# EAGLE design ub-1 (EAGLE 7.5.0)

## Sheet 1 of 2
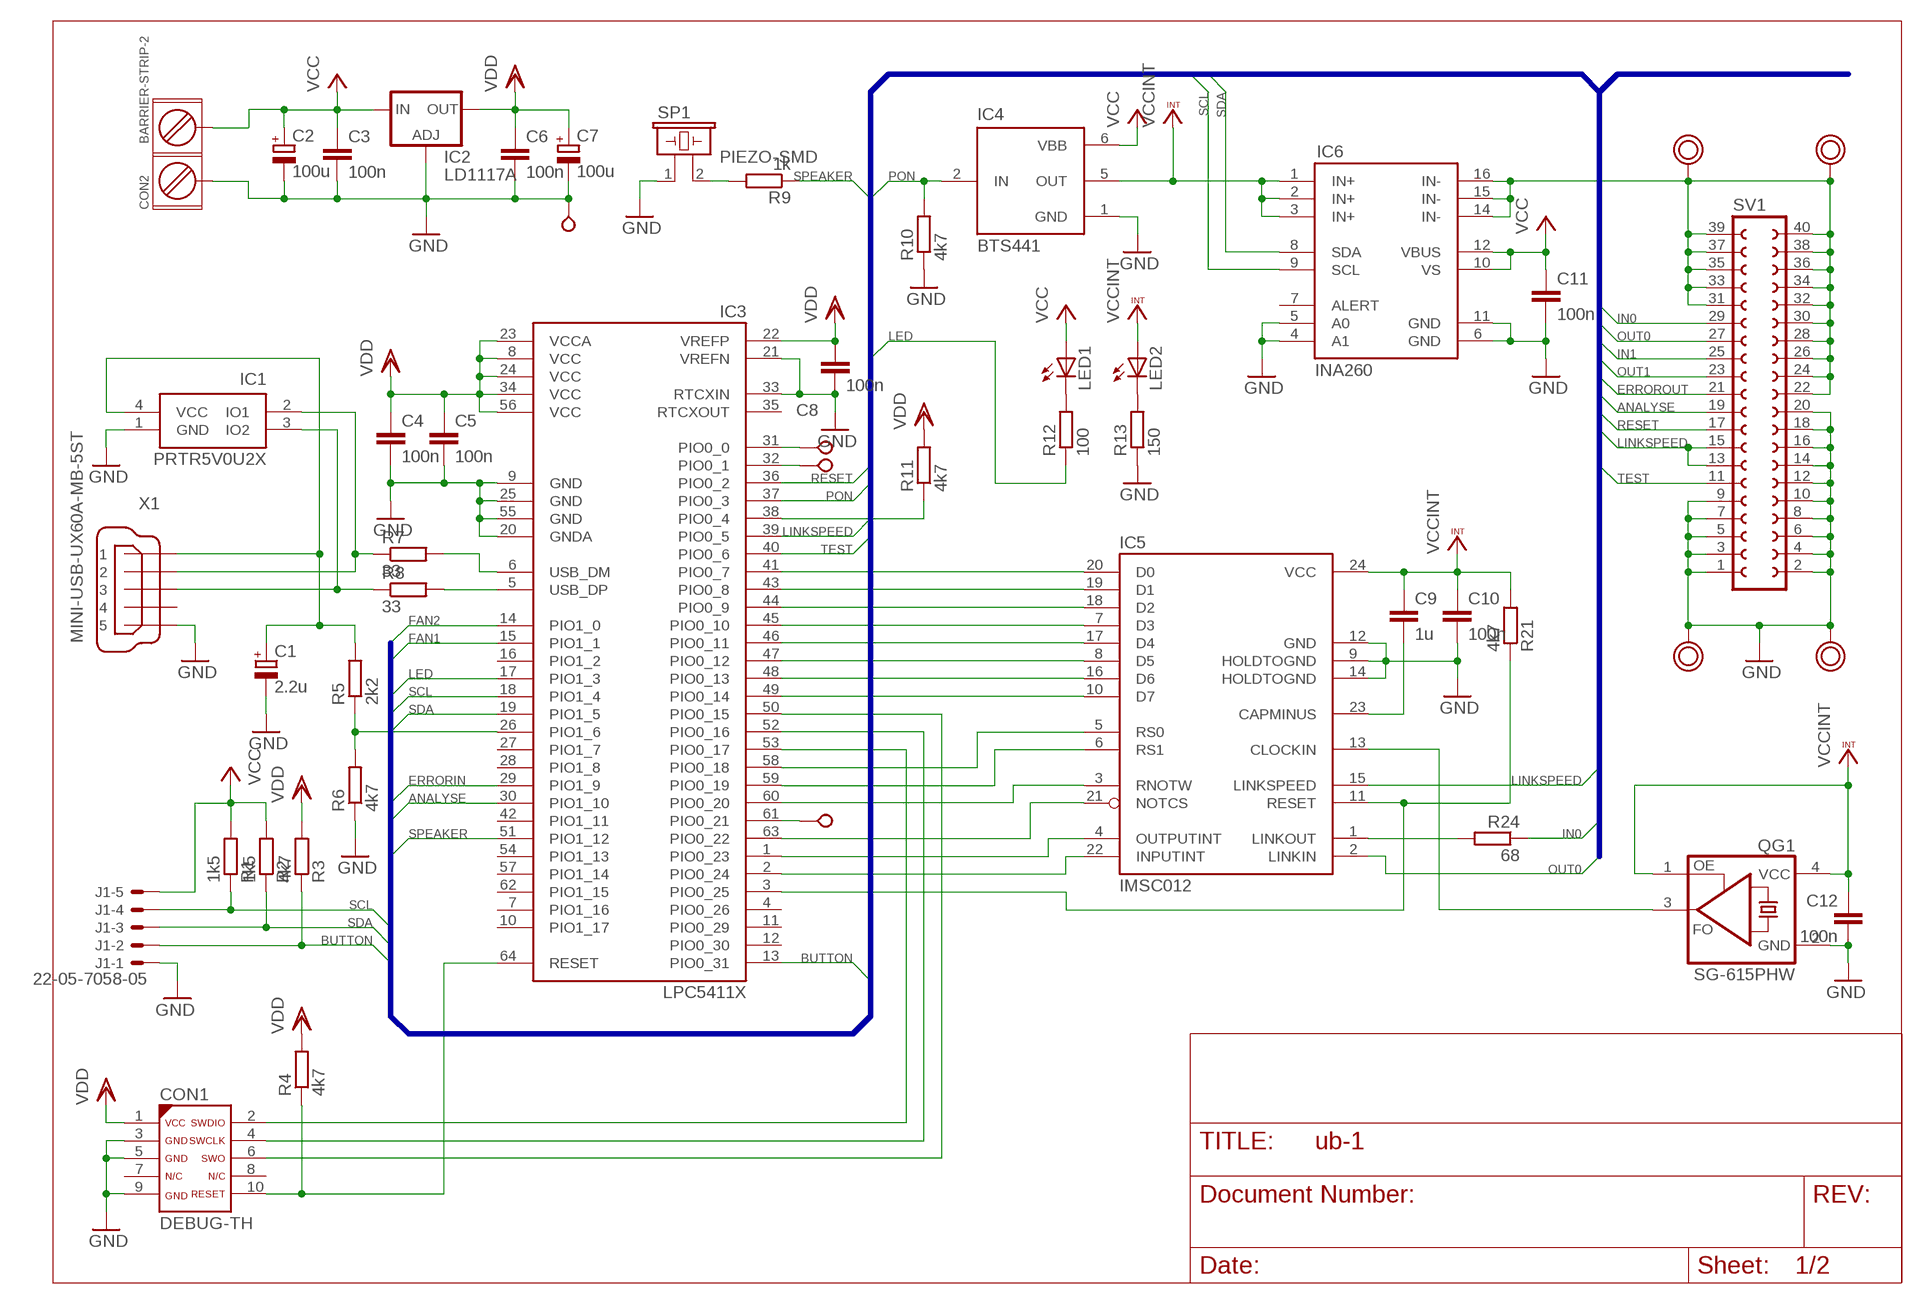
[diagram p0: schematic, sheet 1]

### Parts
C1  2.2u  CPOL-EUSMCB  [SMC_B]
C2  100u  CPOL-EUSMCB  [SMC_B]
C3  100n  C-EUC1206  [C1206]
C4  100n  C-EUC1206  [C1206]
C5  100n  C-EUC1206  [C1206]
C6  100n  C-EUC1206  [C1206]
C7  100u  CPOL-EUSMCB  [SMC_B]
C8  100n  C-EUC1206  [C1206]
C9  1u  C-EUC1206  [C1206]
C10  100n  C-EUC1206  [C1206]
C11  100n  C-EUC1206  [C1206]
C12  100n  C-EUC1206  [C1206]
CON1  DEBUG-TH  [DEBUG-TH]
CON2  BARRIER-STRIP-2  [BARRIER-STRIP-2]
IC1  PRTR5V0U2X  [SOT143]
IC2  LD1117A  [SOT223]
IC3  LPC5411X  [LQPF64]
IC4  BTS441  [TO263-4]
IC5  IMSC012  [DIL24-3]
IC6  INA260  [TSSOP-16]
J1  22-05-7058-05  [7395-05]
LED1  LEDSMT1206  [1206]
LED2  LEDSMT1206  [1206]
QG1  SG-615PHW  [SG-615]
R1  1k5  R-EU_R1206  [R1206]
R2  1k5  R-EU_R1206  [R1206]
R3  4k7  R-EU_R1206  [R1206]
R4  4k7  R-EU_R1206  [R1206]
R5  2k2  R-EU_R1206  [R1206]
R6  4k7  R-EU_R1206  [R1206]
R7  33  R-EU_R1206  [R1206]
R8  33  R-EU_R1206  [R1206]
R9  1k  R-EU_R1206  [R1206]
R10  4k7  R-EU_R1206  [R1206]
R11  4k7  R-EU_R1206  [R1206]
R12  100  R-EU_R1206  [R1206]
R13  150  R-EU_R1206  [R1206]
R21  4k7  R-EU_R1206  [R1206]
R24  68  R-EU_R1206  [R1206]
SCREW1  POWERPAD  [POWERPAD]
SCREW2  POWERPAD  [POWERPAD]
SCREW3  POWERPAD  [POWERPAD]
SCREW4  POWERPAD  [POWERPAD]
SP1  PIEZO-SMD  [PIEZO-SMD]
SV1  FE20-2  [FE20-2]
TP1  TESTPOINT  [VERO_TP]
TP2  TESTPOINT  [VERO_TP]
TP3  TESTPOINT  [VERO_TP]
TP4  TESTPOINT  [VERO_TP]
X1  MINI-USB-UX60A-MB-5ST  [UX60A-MB-5ST]

### Nets
ANALYSE: IC3.30(PIO1_10) SV1.19 ; also sheet 2
BUTTON: IC3.13(PIO0_31) J1.2 R3.1
ERRORIN: IC3.29(PIO1_9) ; also sheet 2
ERROROUT: SV1.21 ; also sheet 2
FAN1: IC3.15(PIO1_1) ; also sheet 2
FAN2: IC3.14(PIO1_0) ; also sheet 2
GND: C1.- C2.- C3.2 C4.2 C5.2 C6.2 C7.- C8.2 C10.2 C11.2 C12.2 CON1.3 CON1.5 CON1.9 CON2.1 IC1.1(GND) IC2.1(ADJ) IC3.9(GND) IC3.20(GNDA) IC3.21(VREFN) IC3.25(GND) IC3.33(RTCXIN) IC3.55(GND) IC4.1(GND) IC5.9(HOLDTOGND) IC5.12(GND) IC5.14(HOLDTOGND) IC6.4(A1) IC6.5(A0) IC6.6(GND) IC6.11(GND) J1.1 QG1.2(GND) R6.1 R10.1 R13.1 SCREW2.P$1 SCREW4.P$1 SP1.1 SV1.1 SV1.2 SV1.3 SV1.4 SV1.5 SV1.6 SV1.7 SV1.8 SV1.9 SV1.10 SV1.12 SV1.14 SV1.16 SV1.18 SV1.20 TP3.P$1 X1.5 ; also sheet 2
IN0: R24.1 SV1.29
IN1: SV1.25 ; also sheet 2
LED: IC3.17(PIO1_3) R12.1
LINKSPEED: IC3.39(PIO0_5) IC5.15(LINKSPEED) SV1.13 SV1.15
N$31: CON1.2 IC3.53(PIO0_17)
N$34: IC3.31(PIO0_0) TP1.P$1
N$35: CON1.4 IC3.52(PIO0_16)
N$36: CON1.10 IC3.64(RESET) R4.1
N$37: IC3.26(PIO1_6) R5.1 R6.2
N$38: IC3.5(USB_DP) R8.2
N$39: IC3.6(USB_DM) R7.2
N$40: IC6.14(IN-) IC6.15(IN-) IC6.16(IN-) SCREW1.P$1 SCREW3.P$1 SV1.22 SV1.24 SV1.26 SV1.28 SV1.30 SV1.31 SV1.32 SV1.33 SV1.34 SV1.35 SV1.36 SV1.37 SV1.38 SV1.39 SV1.40
N$41: IC3.41(PIO0_7) IC5.20(D0)
N$42: IC3.32(PIO0_1) TP2.P$1
N$43: IC3.61(PIO0_21) TP4.P$1
N$44: IC5.1(LINKOUT) R24.2
N$45: IC3.43(PIO0_8) IC5.19(D1)
N$46: IC3.44(PIO0_9) IC5.18(D2)
N$47: IC3.45(PIO0_10) IC5.7(D3)
N$48: IC3.46(PIO0_11) IC5.17(D4)
N$49: IC3.47(PIO0_12) IC5.8(D5)
N$50: IC3.48(PIO0_13) IC5.16(D6)
N$51: IC3.49(PIO0_14) IC5.10(D7)
N$52: IC3.60(PIO0_20) IC5.3(RNOTW)
N$53: IC3.59(PIO0_19) IC5.6(RS1)
N$54: IC3.58(PIO0_18) IC5.5(RS0)
N$55: IC3.1(PIO0_23) IC5.4(OUTPUTINT)
N$56: IC3.2(PIO0_24) IC5.22(INPUTINT)
N$57: IC3.63(PIO0_22) IC5.21(NOTCS)
N$58: IC5.13(CLOCKIN) QG1.3(FO)
N$60: C9.2 IC5.23(CAPMINUS)
N$61: IC1.2(IO1) R7.1 X1.2
N$62: IC1.3(IO2) R8.1 X1.3
N$63: LED2.C R13.2
N$64: R9.2 SP1.2
N$65: LED1.C R12.2
N$71: CON1.6 IC3.50(PIO0_15)
N$72: IC3.38(PIO0_4) R11.1
N$73: IC3.3(PIO0_25) IC5.11(RESET) R21.1
OUT0: IC5.2(LINKIN) SV1.27
OUT1: SV1.23 ; also sheet 2
PON: IC3.37(PIO0_3) IC4.2(IN) R10.2 ; also sheet 2
RESET: IC3.36(PIO0_2) SV1.17 ; also sheet 2
SCL: IC3.18(PIO1_4) IC6.9(SCL) J1.4 R1.1
SDA: IC3.19(PIO1_5) IC6.8(SDA) J1.3 R2.1
SPEAKER: IC3.51(PIO1_12) R9.1
TEST: IC3.40(PIO0_6) SV1.11
VCC: C2.+ C3.1 C11.1 CON2.2 IC2.3(IN) IC4.6(VBB) IC6.10(VS) IC6.12(VBUS) J1.5 LED1.A R1.2 R2.2 ; also sheet 2
VCCINT: C9.1 C10.1 C12.1 IC4.5(OUT) IC5.24(VCC) IC6.1(IN+) IC6.2(IN+) IC6.3(IN+) LED2.A QG1.1(OE) QG1.4(VCC) R21.2 ; also sheet 2
VDD: C4.1 C5.1 C6.1 C7.+ C8.1 CON1.1 IC2.2(OUT) IC3.8(VCC) IC3.22(VREFP) IC3.23(VCCA) IC3.24(VCC) IC3.34(VCC) IC3.56(VCC) R3.2 R4.2 R11.2
VUSB: C1.+ IC1.4(VCC) R5.2 X1.1
Unconnected: CON1.7 CON1.8 IC3.4(PIO0_26) IC3.7(PIO1_16) IC3.10(PIO1_17) IC3.11(PIO0_29) IC3.12(PIO0_30) IC3.16(PIO1_2) IC3.27(PIO1_7) IC3.28(PIO1_8) IC3.35(RTCXOUT) IC3.42(PIO1_11) IC3.54(PIO1_13) IC3.57(PIO1_14) IC3.62(PIO1_15) IC6.7(ALERT) X1.4

### Buses
IN[0..1],OUT[0..1],ERROROUT,ERRORIN,ANALYSE,RESET,PON,LINKSPEED,TEST,FAN[1..2],VUSB,SPEAKER,SDA,SCL,BUTTON,LED

## Sheet 2 of 2
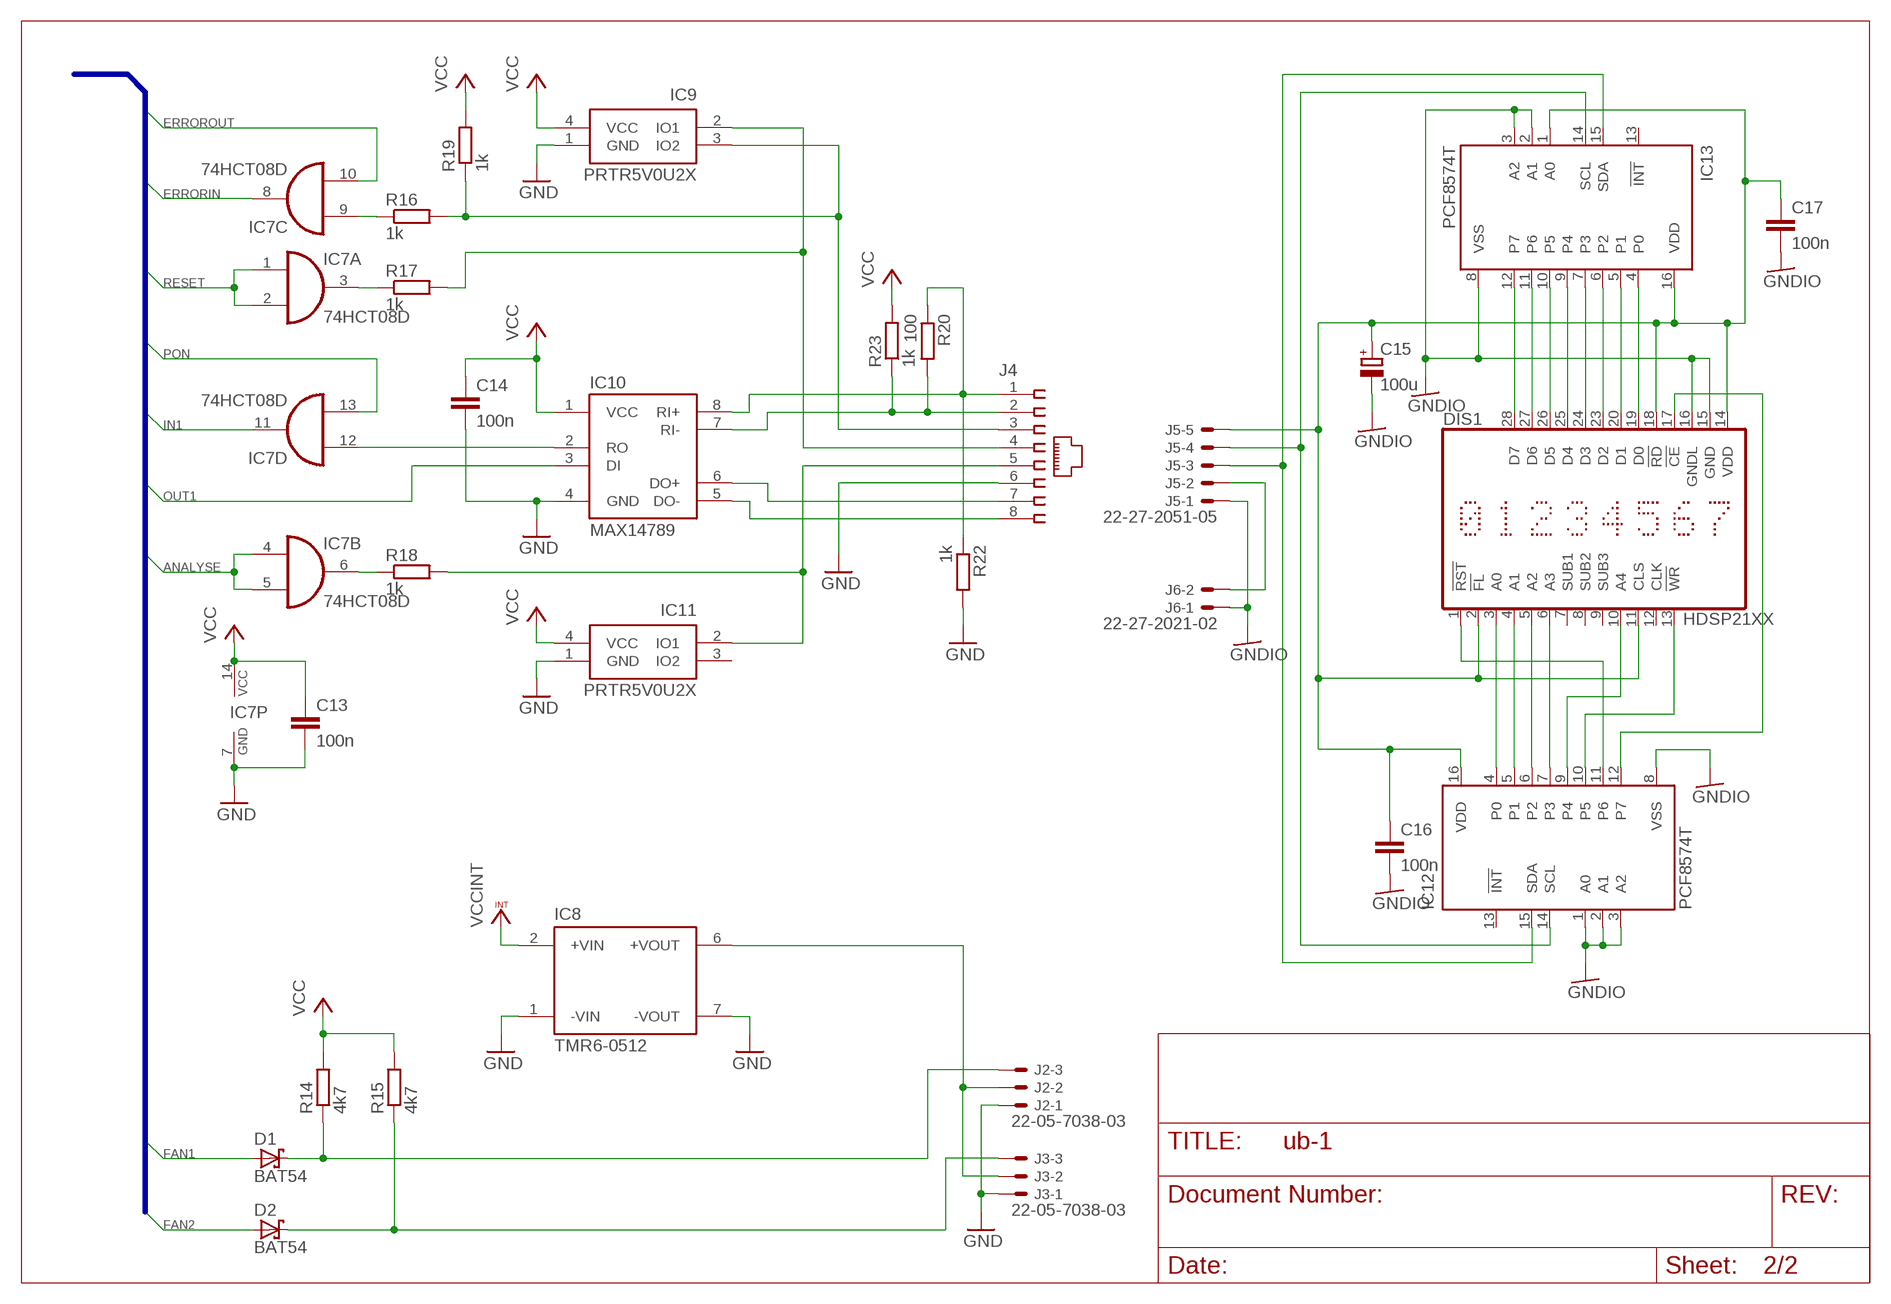
[diagram p1: schematic, sheet 2]

### Parts
C13  100n  C-EUC1206  [C1206]
C14  100n  C-EUC1206  [C1206]
C15  100u  CPOL-EUSMCB  [SMC_B]
C16  100n  C-EUC1206  [C1206]
C17  100n  C-EUC1206  [C1206]
D1  BAT54  [SOT23]
D2  BAT54  [SOT23]
DIS1  HDSP21XX  [HDSP21XX]
IC7  74HCT08D  [SO14]
IC8  TMR6-0512  [TMR6-0512]
IC9  PRTR5V0U2X  [SOT143]
IC10  MAX14789  DS8921  [SO8]
IC11  PRTR5V0U2X  [SOT143]
IC12  PCF8574T  [SO16W]
IC13  PCF8574T  [SO16W]
J2  22-05-7038-03  [7395-03]
J3  22-05-7038-03  [7395-03]
J4  555164-1  [555164-1]
J5  22-27-2051-05  [6410-05]
J6  22-27-2021-02  [6410-02]
R14  4k7  R-EU_R1206  [R1206]
R15  4k7  R-EU_R1206  [R1206]
R16  1k  R-EU_R1206  [R1206]
R17  1k  R-EU_R1206  [R1206]
R18  1k  R-EU_R1206  [R1206]
R19  1k  R-EU_R1206  [R1206]
R20  100  R-EU_R1206  [R1206]
R22  1k  R-EU_R1206  [R1206]
R23  1k  R-EU_R1206  [R1206]

### Nets
ANALYSE: IC7.4(B:I0) IC7.5(B:I1) ; also sheet 1
ERRORIN: IC7.8(C:O) ; also sheet 1
ERROROUT: IC7.10(C:I1) ; also sheet 1
FAN1: D1.1(A) ; also sheet 1
FAN2: D2.1(A) ; also sheet 1
GND: C13.2 C14.2 IC7.7(P:GND) IC8.1(-VIN) IC8.7(-VOUT) IC9.1(GND) IC10.4(GND) IC11.1(GND) J2.1 J3.1 J4.6 R22.2 ; also sheet 1
GNDIO: C15.- C16.2 C17.2 DIS1.15(GND) DIS1.16(GNDL) IC12.1(A0) IC12.2(A1) IC12.3(A2) IC12.8(VSS) IC13.2(A1) IC13.3(A2) IC13.8(VSS) J5.1 J6.1
IN1: IC7.11(D:O) ; also sheet 1
N$1: DIS1.3(A0) IC12.4(P0)
N$2: DIS1.19(D0) IC13.4(P0)
N$3: DIS1.20(D1) IC13.5(P1)
N$4: DIS1.23(D2) IC13.6(P2)
N$5: DIS1.24(D3) IC13.7(P3)
N$6: DIS1.25(D4) IC13.9(P4)
N$7: DIS1.26(D5) IC13.10(P5)
N$8: DIS1.27(D6) IC13.11(P6)
N$9: DIS1.28(D7) IC13.12(P7)
N$10: DIS1.4(A1) IC12.5(P1)
N$11: DIS1.5(A2) IC12.6(P2)
N$12: DIS1.6(A3) IC12.7(P3)
N$13: DIS1.10(A4) IC12.9(P4)
N$14: J5.2 J6.2
N$15: C15.+ C16.1 C17.1 DIS1.2(!FL) DIS1.11(CLS) DIS1.14(VDD) DIS1.18(!RD) IC12.16(VDD) IC13.1(A0) IC13.16(VDD) J5.5
N$16: DIS1.1(!RST) IC12.11(P6)
N$17: DIS1.13(!WR) IC12.10(P5)
N$18: IC12.14(SCL) IC13.14(SCL) J5.4
N$19: DIS1.17(!CE) IC12.12(P7)
N$20: IC12.15(SDA) IC13.15(SDA) J5.3
N$21: IC10.8(RI+) J4.1 R20.1 R22.1
N$22: IC10.7(RI-) J4.2 R20.2 R23.1
N$23: IC10.5(DO-) J4.8
N$24: IC10.6(DO+) J4.7
N$25: IC7.6(B:O) R18.1
N$26: IC7.3(A:O) R17.1
N$27: IC7.9(C:I0) R16.1
N$28: IC9.3(IO2) J4.3 R16.2 R19.1
N$29: IC9.2(IO1) J4.4 R17.2
N$30: IC11.2(IO1) J4.5 R18.2
N$32: IC7.12(D:I0) IC10.2(RO)
N$33: D2.3(C) J3.3 R15.1
N$59: D1.3(C) J2.3 R14.1
N$67: IC8.6(+VOUT) J2.2 J3.2
OUT1: IC10.3(DI) ; also sheet 1
PON: IC7.13(D:I1) ; also sheet 1
RESET: IC7.1(A:I0) IC7.2(A:I1) ; also sheet 1
VCC: C13.1 C14.1 IC7.14(P:VCC) IC9.4(VCC) IC10.1(VCC) IC11.4(VCC) R14.2 R15.2 R19.2 R23.2 ; also sheet 1
VCCINT: IC8.2(+VIN) ; also sheet 1
Unconnected: DIS1.7(SUB1) DIS1.8(SUB2) DIS1.9(SUB3) DIS1.12(CLK) IC11.3(IO2) IC12.13(!INT) IC13.13(!INT)

### Buses
IN[0..1],OUT[0..1],ERROROUT,ERRORIN,ANALYSE,RESET,PON,LINKSPEED,TEST,FAN[1..2],VUSB,SPEAKER,SDA,SCL,BUTTON,LED

## Library data of the parts
C1 = rcl:CPOL-EU: POLARIZED CAPACITOR, European symbol; DIGIKEY: 478-3880-1-ND
C2 C7 C15 = rcl:CPOL-EU: POLARIZED CAPACITOR, European symbol; DIGIKEY: 478-5801-1-ND
C3-C6 C8 C10-C14 C16 C17 = rcl:C-EU: CAPACITOR, European symbol; DIGIKEY: 478-10855-1-ND
C9 = rcl:C-EU: CAPACITOR, European symbol; DIGIKEY: 478-1567-1-ND
CON1 = Transputer:DEBUG; DIGIKEY: 1175-1627-ND
CON2 = Transputer:BARRIER-STRIP-2; DIGIKEY: WM13929-ND
D1 D2 = diode:BAT54: Schottky Diodes Source: Fairchild .. BAT54.pdf; DIGIKEY: BAT54FSCT-ND
DIS1 = display-hp:HDSP21XX: LED DISPLAY 8-character dot matrix; DIGIKEY: 516-1161-5-ND; MF: AGILENT TECHNOLOGIES; MPN: HDSP-2179; OC_FARNELL: 1175588; OC_NEWARK: 06B1344
IC1 IC9 IC11 = Transputer:PRTR5V0U2X; DIGIKEY: 1727-3884-1-ND
IC2 = Transputer:LD1117A; DIGIKEY: 497-1228-1-ND
IC3 = Transputer:LPC5411X; DIGIKEY: 568-13034-ND
IC4 = Transputer:BTS441; DIGIKEY: BTS441TGATMA1CT-ND
IC5 = Transputer:IMSC012
IC6 = Transputer:INA260; DIGIKEY: 296-47777-1-ND
IC7 = 74xx-eu:74*08: Quad 2-input AND gate; DIGIKEY: 296-14862-1-ND
IC8 = Transputer:TMR6-0512; DIGIKEY: 1951-2391-ND
IC10 = Transputer:DS8921; DIGIKEY: MAX14789EGSA+-ND
IC12 IC13 = micro-philips:PCF8574: I2C-Bus Remote 8-bit I/O expander http://www.semiconductors.philips.com/acrobat_download/datasheets/PCF8574_4.pdf; DIGIKEY: 568-1077-1-ND; MPN: PCF8574T/3,512; OC_FARNELL: 1201255; OC_NEWARK: 70R6870
J1 = con-molex:22-?-05: CONNECTOR wire to board 2.54 mm (.1 inch) pitch header; DIGIKEY: WM2787-ND; OC_FARNELL: unknown; OC_NEWARK: unknown
J2 J3 = con-molex:22-?-03: CONNECTOR wire to board 2.54 mm (.1 inch) pitch header; DIGIKEY: WM2785-ND; OC_FARNELL: unknown; OC_NEWARK: unknown
J4 = con-amp:555164-1: AMP connector; DIGIKEY: A31442-ND
J5 = con-molex:22-?-05: CONNECTOR wire to board 2.54 mm (.1 inch) pitch header; DIGIKEY: WM4114-ND; OC_FARNELL: unknown; OC_NEWARK: unknown
J6 = con-molex:22-?-02: CONNECTOR wire to board 2.54 mm (.1 inch) pitch header; DIGIKEY: WM4111-ND; OC_FARNELL: unknown; OC_NEWARK: unknown
LED1 LED2 = led:LED: LED OSRAM: - CHIPLED LG R971, LG N971, LY N971, LG Q971, LY Q971, LO R971, LY R971 LH N974, LH R974 LS Q976, LO Q976, LY Q976 LO Q996 - Hyper CHIPLED LW Q18S LB Q993, LB Q99A, LB R99A - SideLED LS A670, LO A670, LY A670, LG A670, LP A670 LB A673, LV A673, LT A673, LW A673 LH A674 LY A675 LS A676, LA A676, LO A676, LY A676, LW A676 LS A679, LY A679, LG A679 - Hyper Micro SIDELED® LS Y876, LA Y876, LO Y876, LY Y876 LT Y87S - SmartLED LW L88C, LW L88S LB L89C, LB L89S, LG L890 LS L89K, LO L89K, LY L89K LS L896, LA L896, LO L896, LY L896 - TOPLED LS T670, LO T670, LY T670, LG T670, LP T670 LSG T670, LSP T670, LSY T670, LOP T670, LYG T670 LG T671, LOG T671, LSG T671 LB T673, LV T673, LT T673, LW T673 LH T674 LS T676, LA T676, LO T676, LY T676, LB T676, LH T676, LSB T676, LW T676 LB T67C, LV T67C, LT T67C, LS T67K, LO T67K, LY T67K, LW E67C LS E67B, LA E67B, LO E67B, LY E67B, LB E67C, LV E67C, LT E67C LW T67C LS T679, LY T679, LG T679 LS T770, LO T770, LY T770, LG T770, LP T770 LB T773, LV T773, LT T773, LW T773 LH T774 LS E675, LA E675, LY E675, LS T675 LS T776, LA T776, LO T776, LY T776, LB T776 LHGB T686 LT T68C, LB T68C - Hyper Mini TOPLED® LB M676 - Mini TOPLED Santana® LG M470 LS M47K, LO M47K, LY M47K Source: http://www.osram.convergy.de LUXEON: - LUMILED® LXK2-PW12-R00, LXK2-PW12-S00, LXK2-PW14-U00, LXK2-PW14-V00 LXK2-PM12-R00, LXK2-PM12-S00, LXK2-PM14-U00 LXK2-PE12-Q00, LXK2-PE12-R00, LXK2-PE12-S00, LXK2-PE14-T00, LXK2-PE14-U00 LXK2-PB12-K00, LXK2-PB12-L00, LXK2-PB12-M00, LXK2-PB14-N00, LXK2-PB14-P00, LXK2-PB14-Q00 LXK2-PR12-L00, LXK2-PR12-M00, LXK2-PR14-Q00, LXK2-PR14-R00 LXK2-PD12-Q00, LXK2-PD12-R00, LXK2-PD12-S00 LXK2-PH12-R00, LXK2-PH12-S00 LXK2-PL12-P00, LXK2-PL12-Q00, LXK2-PL12-R00 Source: www.luxeon.com KINGBRIGHT: KA-3528ASYC Source: www.kingbright.com; DIGIKEY: 160-1404-1-ND
QG1 = crystal:SG-615: SOJ HIGH-FREQUENCY CRYSTAL OSCILLATOR Source: Crystal Oscillator SG-615%20Series.pdf; OC_FARNELL: unknown; OC_NEWARK: unknown
R1 R2 = rcl:R-EU_: RESISTOR, European symbol; DIGIKEY: CR1206-FX-1501ELFCT-ND
R3 R4 R6 R10 R11 R14 R15 R21 = rcl:R-EU_: RESISTOR, European symbol; DIGIKEY: CR1206-FX-4701ELFCT-ND
R5 = rcl:R-EU_: RESISTOR, European symbol; DIGIKEY: CR1206-FX-2201ELFCT-ND
R7 R8 = rcl:R-EU_: RESISTOR, European symbol; DIGIKEY: CRS1206-FX-33R0ELFCT-ND
R9 R16-R19 R22 R23 = rcl:R-EU_: RESISTOR, European symbol; DIGIKEY: CR1206-FX-1001ELFCT-ND
R12 R20 = rcl:R-EU_: RESISTOR, European symbol; DIGIKEY: CR1206-FX-1000ELFCT-ND
R13 = rcl:R-EU_: RESISTOR, European symbol; DIGIKEY: CR1206-FX-1500ELFCT-ND
R24 = rcl:R-EU_: RESISTOR, European symbol; DIGIKEY: CR1206-FX-68R0ELFCT-ND
SCREW1-SCREW4 = Transputer:POWERPAD
SP1 = Transputer:PIEZO-SMD; DIGIKEY: 490-9647-1-ND
SV1 = con-lsta:FE20-2: FEMALE HEADER; OC_FARNELL: unknown; OC_NEWARK: unknown
TP1-TP4 = Transputer:TESTPOINT
X1 = con-hirose:MINI-USB-: MINI USB Connector Source: http://www.hirose.co.jp/cataloge_hp/e24000019.pdf; DIGIKEY: H2961CT-ND; OC_FARNELL: unknown; OC_NEWARK: unknown

## Board
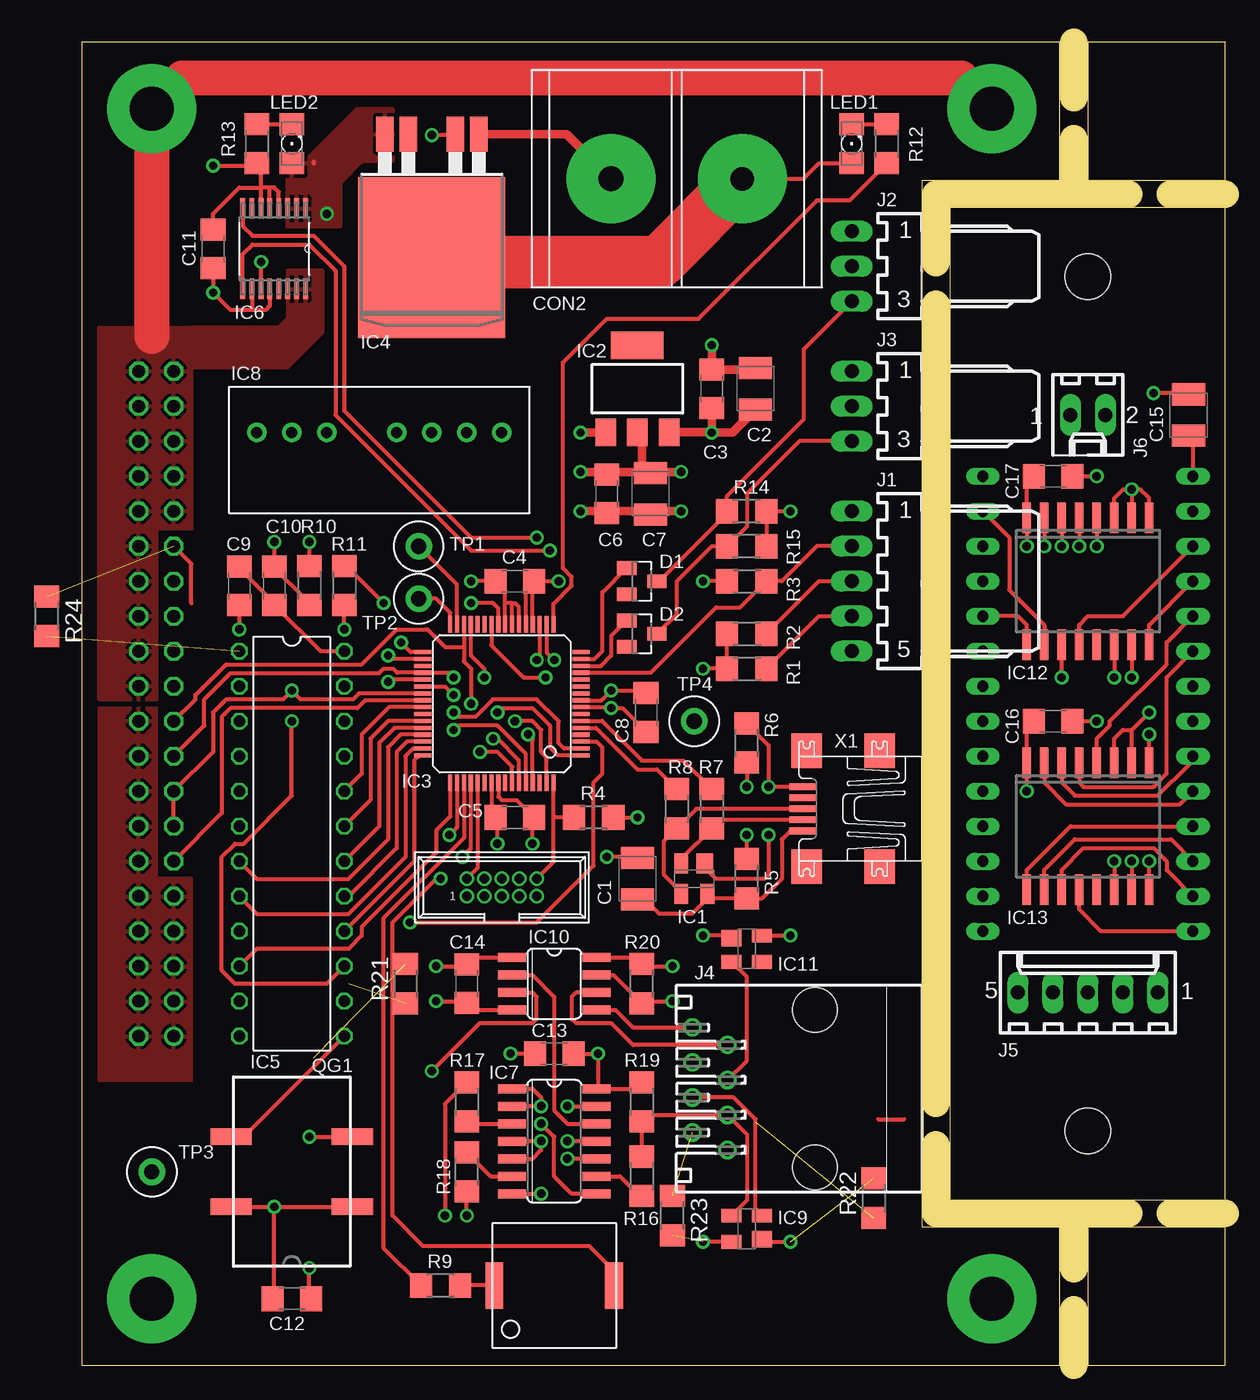
[diagram p2: board, top side]
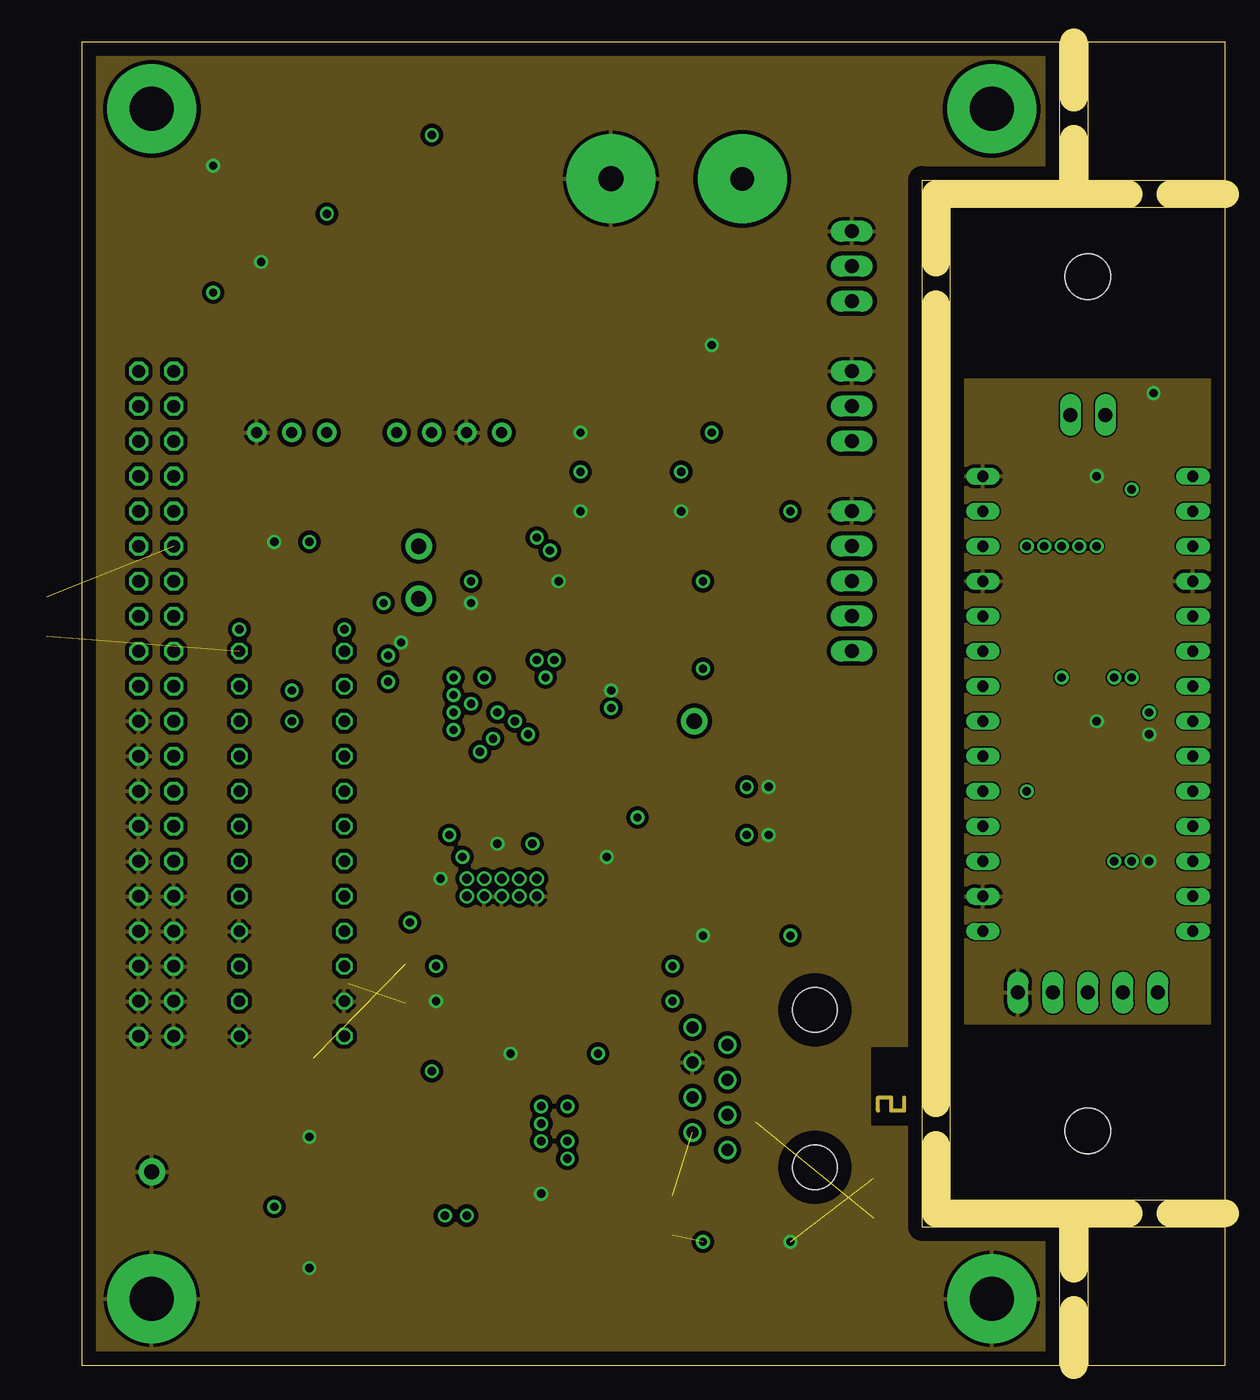
[diagram p3: board, inner layer Route2]
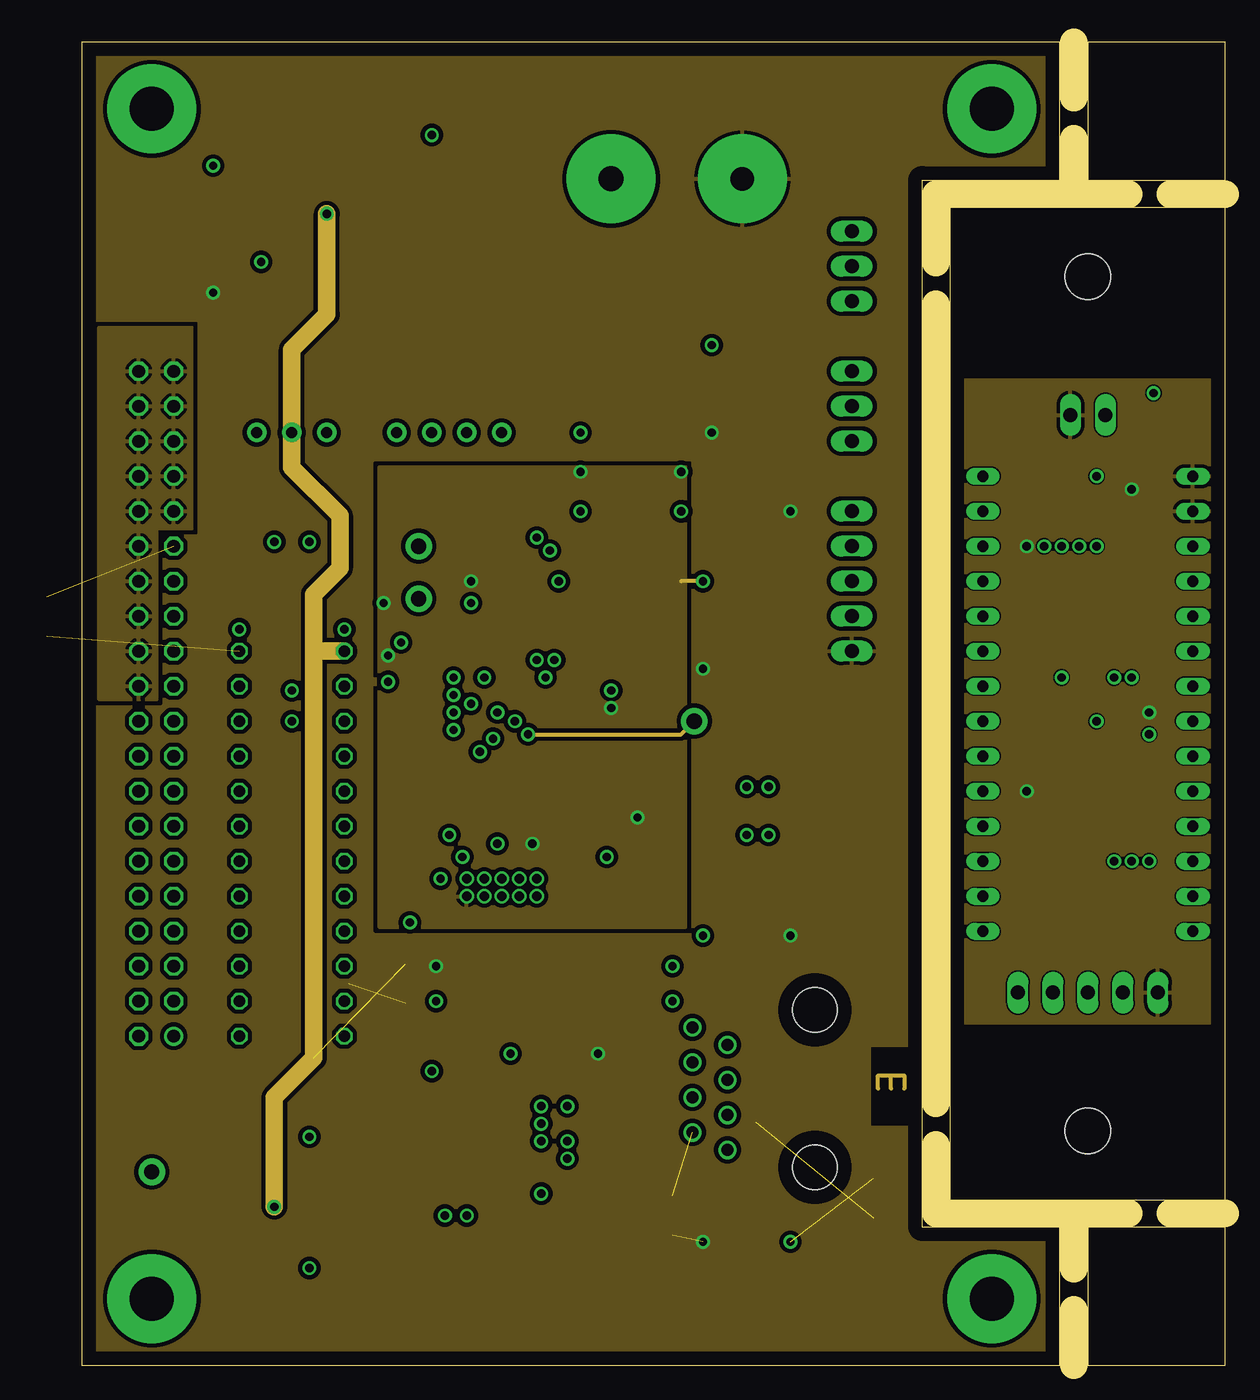
[diagram p4: board, inner layer Route15]
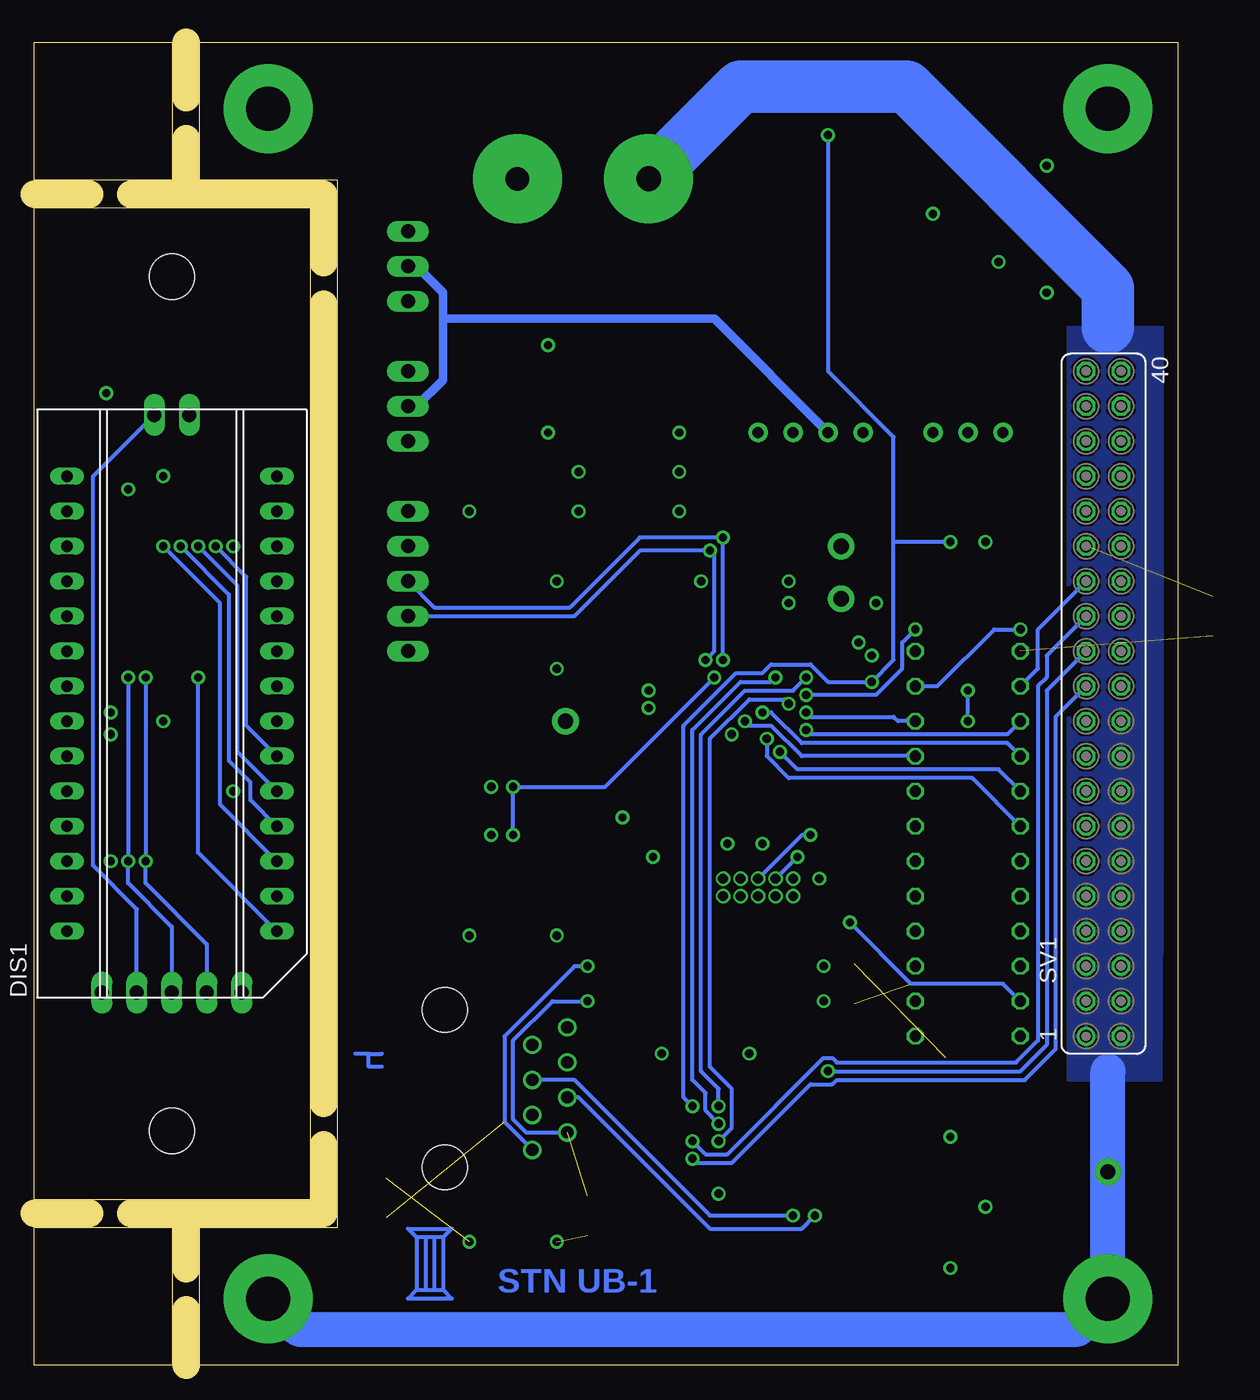
[diagram p5: board, bottom side, seen from below]

Size 83 x 96 mm. Coordinates in mm from the lower left corner, seen from the top.
Outline: 0,0 71,0 71,10 61,10 61,86 71,86 71,96 0,96 0,0
Outline: 73,96 73,86 83,86 83,96 73,96
Outline: 73,10 73,0 83,0 83,10 73,10
Outline: 63,84 63,12 83,12 83,84 63,84
Copper layers (1*2*15*16): Top 0.035mm / dielectric 1.5mm / Route2 0.035mm / dielectric 0.15mm / Route15 0.035mm / dielectric 0.2mm / Bottom 0.035mm
Design rules "wedirect *": minimum track width 0.1mm, minimum drill 16mil, track to track 0.1mm, track to pad 0.1mm, pad to pad 0.1mm, via to via 0.1mm, smd to smd 0.1mm, copper to edge 40mil, drill to drill 8mil, minimum pad ring 0.1mm, minimum via ring 8mil, stop-mask expansion 2mil, vias tented up to drill 0mil, thermal gap 10mil
Holes 3.3 mm at 73.03,17 73.03,79
Milling: 13 lines

### Footprints (pad centres in the part's own frame; a part is rotated, then mirrored left to right if it is on the bottom)
SMC_B = smd 1.6 x 2.4: + -1.5,0; - 1.5,0
C1206 = smd 1.6 x 1.8: 1 -1.4,0; 2 1.4,0
DEBUG-TH = drill 0.7 pad 1.016: 1 -2.54,-0.635; 2 -2.54,0.635; 3 -1.27,-0.635; 4 -1.27,0.635; 5 0,-0.635; 6 0,0.635; 7 1.27,-0.635; 8 1.27,0.635; 9 2.54,-0.635; 10 2.54,0.635
BARRIER-STRIP-2 = drill 1.8 pad 6.452: 1 -4.763,0 | drill 1.7 pad 6.452: 2 4.763,0
SOT23 = smd 1 x 1.4: 1 -0.95,-1.1; 2 0.95,-1.1; 3 0,1.1
HDSP21XX = drill 0.813 long: 1 -16.51,-7.62; 2 -13.97,-7.62; 3 -11.43,-7.62; 4 -8.89,-7.62; 5 -6.35,-7.62; 6 -3.81,-7.62; 7 -1.27,-7.62; 8 1.27,-7.62; 9 3.81,-7.62; 10 6.35,-7.62; 11 8.89,-7.62; 12 11.43,-7.62; 13 13.97,-7.62; 14 16.51,-7.62; 15 16.51,7.62; 16 13.97,7.62; 17 11.43,7.62; 18 8.89,7.62; 19 6.35,7.62; 20 3.81,7.62; 21 1.27,7.62; 22 -1.27,7.62; 23 -3.81,7.62; 24 -6.35,7.62; 25 -8.89,7.62; 26 -11.43,7.62; 27 -13.97,7.62; 28 -16.51,7.62
SOT143 = smd 1.2 x 1.44: 1 -0.75,-1.1 | smd 1 x 1.44: 2 0.95,-1.1; 3 0.95,1.1; 4 -0.95,1.1
SOT223 = smd 1.5 x 2: 1 -2.3,-3.15; 2 0,-3.15; 3 2.3,-3.15 | smd 3.8 x 2: 4 0,3.15
LQPF64 = smd 1.2 x 0.3: 1 -5.75,3.75; 2 -5.75,3.25; 3 -5.75,2.75; 4 -5.75,2.25; 5 -5.75,1.75; 6 -5.75,1.25; 7 -5.75,0.75; 8 -5.75,0.25; 9 -5.75,-0.25; 10 -5.75,-0.75; 11 -5.75,-1.25; 12 -5.75,-1.75; 13 -5.75,-2.25; 14 -5.75,-2.75; 15 -5.75,-3.25; 16 -5.75,-3.75; 33 5.75,-3.75; 34 5.75,-3.25; 35 5.75,-2.75; 36 5.75,-2.25; 37 5.75,-1.75; 38 5.75,-1.25; 39 5.75,-0.75; 40 5.75,-0.25; 41 5.75,0.25; 42 5.75,0.75; 43 5.75,1.25; 44 5.75,1.75; 45 5.75,2.25; 46 5.75,2.75; 47 5.75,3.25; 48 5.75,3.75 | smd 0.3 x 1.2: 17 -3.75,-5.75; 18 -3.25,-5.75; 19 -2.75,-5.75; 20 -2.25,-5.75; 21 -1.75,-5.75; 22 -1.25,-5.75; 23 -0.75,-5.75; 24 -0.25,-5.75; 25 0.25,-5.75; 26 0.75,-5.75; 27 1.25,-5.75; 28 1.75,-5.75; 29 2.25,-5.75; 30 2.75,-5.75; 31 3.25,-5.75; 32 3.75,-5.75; 49 3.75,5.75; 50 3.25,5.75; 51 2.75,5.75; 52 2.25,5.75; 53 1.75,5.75; 54 1.25,5.75; 55 0.75,5.75; 56 0.25,5.75; 57 -0.25,5.75; 58 -0.75,5.75; 59 -1.25,5.75; 60 -1.75,5.75; 61 -2.25,5.75; 62 -2.75,5.75; 63 -3.25,5.75; 64 -3.75,5.75
TO263-4 = smd 1.27 x 2.54: 1 -3.404,-5.791; 2 -1.702,-5.791; 4 1.702,-5.791; 5 3.404,-5.791 | smd 10.668 x 11.684: 6 0,3.175
DIL24-3 = drill 0.813 octagon: 1 -12.7,-3.81; 2 -10.16,-3.81; 3 -7.62,-3.81; 4 -5.08,-3.81; 5 -2.54,-3.81; 6 0,-3.81; 7 2.54,-3.81; 8 5.08,-3.81; 9 7.62,-3.81; 10 10.16,-3.81; 11 12.7,-3.81; 12 15.24,-3.81; 13 15.24,3.81; 14 12.7,3.81; 15 10.16,3.81; 16 7.62,3.81; 17 5.08,3.81; 18 2.54,3.81; 19 0,3.81; 20 -2.54,3.81; 21 -5.08,3.81; 22 -7.62,3.81; 23 -10.16,3.81; 24 -12.7,3.81
TSSOP-16 = smd 1.473 x 0.356: 1 -2.921,2.286; 2 -2.921,1.626; 3 -2.921,0.965; 4 -2.921,0.33; 5 -2.921,-0.33; 6 -2.921,-0.965; 7 -2.921,-1.626; 8 -2.921,-2.286; 9 2.921,-2.286; 10 2.921,-1.626; 11 2.921,-0.965; 12 2.921,-0.33; 13 2.921,0.33; 14 2.921,0.965; 15 2.921,1.626; 16 2.921,2.286
SO14 = smd 0.66 x 2.032: 1 -3.81,-3.073; 2 -2.54,-3.073; 3 -1.27,-3.073; 4 0,-3.073; 5 1.27,-3.073; 6 2.54,-3.073; 7 3.81,-3.073; 8 3.81,3.073; 9 2.54,3.073; 10 1.27,3.073; 11 0,3.073; 12 -1.27,3.073; 13 -2.54,3.073; 14 -3.81,3.073
TMR6-0512 = drill 0.8 pad 1.422: 1 -8.89,0; 2 -6.35,0; 3 -3.81,0; 5 1.27,0; 6 3.81,0; 7 6.35,0; 8 8.89,0
SO8 = smd 0.66 x 2.032: 1 -1.905,-3.073; 2 -0.635,-3.073; 3 0.635,-3.073; 4 1.905,-3.073; 5 1.905,3.073; 6 0.635,3.073; 7 -0.635,3.073; 8 -1.905,3.073
SO16W = smd 0.6 x 2.2: 1 -4.445,-4.6; 2 -3.175,-4.6; 3 -1.905,-4.6; 4 -0.635,-4.6; 5 0.635,-4.6; 6 1.905,-4.6; 7 3.175,-4.6; 8 4.445,-4.6; 9 4.445,4.6; 10 3.175,4.6; 11 1.905,4.6; 12 0.635,4.6; 13 -0.635,4.6; 14 -1.905,4.6; 15 -3.175,4.6; 16 -4.445,4.6
7395-05 = drill 1.016 long: 1 5.08,0; 2 2.54,0; 3 0,0; 4 -2.54,0; 5 -5.08,0
7395-03 = drill 1.016 long: 1 2.54,0; 2 0,0; 3 -2.54,0
555164-1 = drill 0.889: 1 -4.445,5.207; 2 -3.175,7.747; 3 -1.905,5.207; 4 -0.635,7.747; 5 0.635,5.207; 6 1.905,7.747; 7 3.175,5.207; 8 4.445,7.747 | hole 3.251: -5.715,-1.143; 5.715,-1.143
6410-05 = drill 1.016 long: 1 5.08,0; 2 2.54,0; 3 0,0; 4 -2.54,0; 5 -5.08,0
6410-02 = drill 1.016 long: 1 1.27,0; 2 -1.27,0
1206 = smd 1.6 x 1.803: A -1.422,0; C 1.422,0
SG-615 = smd 1.2 x 3: 1 -2.54,-4.4; 2 2.54,-4.4; 3 2.54,4.4; 4 -2.54,4.4
R1206 = smd 1.6 x 1.803: 1 -1.422,0; 2 1.422,0
POWERPAD = drill 3.2 pad 6.452: P$1 0,0
PIEZO-SMD = smd 1.3 x 3.4: 1 -4.35,0; 2 4.35,0
FE20-2 = drill 0.914: 1 -24.13,1.27 | drill 0.914 octagon: 2 -24.13,-1.27; 3 -21.59,1.27; 4 -21.59,-1.27; 5 -19.05,1.27; 6 -19.05,-1.27; 7 -16.51,1.27; 8 -16.51,-1.27; 9 -13.97,1.27; 10 -13.97,-1.27; 11 -11.43,1.27; 12 -11.43,-1.27; 13 -8.89,1.27; 14 -8.89,-1.27; 15 -6.35,1.27; 16 -6.35,-1.27; 17 -3.81,1.27; 18 -3.81,-1.27; 19 -1.27,1.27; 20 -1.27,-1.27; 21 1.27,1.27; 22 1.27,-1.27; 23 3.81,1.27; 24 3.81,-1.27; 25 6.35,1.27; 26 6.35,-1.27; 27 8.89,1.27; 28 8.89,-1.27; 29 11.43,1.27; 30 11.43,-1.27; 31 13.97,1.27; 32 13.97,-1.27; 33 16.51,1.27; 34 16.51,-1.27; 35 19.05,1.27; 36 19.05,-1.27; 37 21.59,1.27; 38 21.59,-1.27; 39 24.13,1.27; 40 24.13,-1.27
VERO_TP = drill 1.1 pad 1.93: P$1 0,0
UX60A-MB-5ST = smd 2 x 0.5: 1 2.25,1.6; 2 2.25,0.8; 3 2.25,0; 4 2.25,-0.8; 5 2.25,-1.6 | smd 2.2 x 2.5: M1 -3.3,-4.2; M2 -3.3,4.2; M3 2,4.2; M4 2,-4.2

### Placement (x,y rotation side)
C1  40.32,35.3 90 top
C2  48.9,70.86 90 top
C3  45.72,70.86 90 top
C4  31.43,56.89 0 top
C5  31.43,39.74 180 top
C6  38.1,63.24 270 top
C7  41.27,63.24 270 top
C8  40.96,47.37 90 top
C9  11.43,56.57 270 top
C10  13.97,56.57 90 top
C11  9.53,81.02 90 top
C12  15.24,4.82 0 top
C13  34.29,22.6 180 top
C14  27.94,27.68 270 top
C15  80.33,68.95 270 top
C16  70.48,46.73 180 top
C17  70.48,64.51 180 top
CON1  30.48,34.66 0 top
CON2  43.18,86.1 0 top
D1  40.64,56.89 270 top
D2  40.64,53.08 270 top
DIS1  73.03,48 90 bottom
IC1  44.45,35.3 180 top
IC2  40.32,70.86 0 top
IC3  30.48,48 180 top
IC4  25.4,83.56 180 top
IC5  15.24,39.11 270 top
IC6  13.97,81.02 270 top
IC7  34.29,16.25 270 top
IC8  21.59,67.69 0 top
IC9  48.26,9.9 90 top
IC10  34.29,27.68 270 top
IC11  48.26,30.22 270 top
IC12  73.03,56.89 180 top
IC13  73.03,39.11 180 top
J1  55.88,56.89 90 top
J2  55.88,79.75 90 top
J3  55.88,69.59 90 top
J4  52.07,20.06 90 top
J5  73.03,27.05 0 top
J6  73.03,68.95 180 top
LED1  55.88,88.64 90 top
LED2  15.24,88.64 90 top
QG1  15.24,14.03 90 top
R1  48.26,50.54 180 top
R2  48.26,53.08 180 top
R3  48.26,56.89 180 top
R4  37.15,39.74 0 top
R5  48.26,35.3 270 top
R6  48.26,45.14 270 top
R7  45.72,40.38 90 top
R8  43.18,40.38 90 top
R9  26.04,5.77 0 top
R10  16.51,56.57 90 top
R11  19.05,56.57 90 top
R12  58.42,88.64 90 top
R13  12.7,88.64 90 top
R14  48.26,61.97 0 top
R15  48.26,59.43 0 top
R16  40.64,13.71 90 top
R17  27.94,19.11 90 top
R18  27.94,14.03 270 top
R19  40.64,19.11 90 top
R20  40.64,27.68 270 top
R21  23.5,27.68 90 top
R22  57.47,12.12 90 top
R23  42.86,10.85 270 top
R24  -2.54,54.35 270 top
SCREW1  66.04,91.18 0 top
SCREW2  66.04,4.82 0 top
SCREW3  5.08,91.18 0 top
SCREW4  5.08,4.82 0 top
SP1  34.29,5.77 180 top
SV1  5.4,48 90 bottom
TP1  24.45,59.43 0 top
TP2  24.45,55.62 0 top
TP3  5.08,14.03 0 top
TP4  44.45,46.73 0 top
U$5  [LAYER14]  58.74,20.06 90 top
U$6  [LOGO]  54.29,7.36 0 bottom
X1  54.61,40.38 180 top

### Tracks (layer width: path | path; a pad name or v marks a point on that pad's centre or on a via)
ANALYSE  (via drill 0.6)
  Top 0.305: IC7.5 32.7,14.98 33.34,15.62 v33.34,16.25 IC7.4 | SV1.19 8.26,48.32 8.26,48.63 10.48,50.86 20.32,50.86 22.86,53.4 25.08,53.4 26.35,52.13 27.73,52.13 | v28.26,48 28.26,50.54 27.73,51.07 27.73,52.13 | IC3.30 27.73,52.13
  Bottom 0.305: v33.34,16.25 32.38,17.2 32.38,20.06 33.97,21.65 33.97,45.46 31.11,48.32 28.57,48.32 v28.26,48
BUTTON
  Top 0.305: IC3.13 41.3,50.25 46.04,54.98 47.78,54.98 R3.1 50.8,56.89 53.34,59.43 J1.2
ERRORIN  (via drill 0.6)
  Top 0.305: IC7.8 35.56,12.44 34.29,13.71 34.29,16.57 v33.34,17.52 | v29.21,49.91 29.21,50.54 28.23,51.52 IC3.29
  Bottom 0.305: v33.34,17.52 34.29,18.47 34.29,19.74 35.24,20.7 35.24,46.09 31.75,49.59 29.53,49.59 v29.21,49.91
ERROROUT  (via drill 0.6)
  Top 0.305: IC7.10 v35.24,14.98
  Bottom 0.305: v35.24,14.98 34.92,14.66 32.38,14.66 26.67,20.38 25.08,20.38 24.77,20.7 11.11,20.7 8.89,22.92 8.89,47.05 SV1.21
FAN1
  Top 0.305: IC3.15 37.22,51.25 37.78,51.81 37.78,56.08 D1.1
FAN2
  Top 0.305: IC3.14 37.67,50.75 38.42,51.49 38.42,52.91 D2.1
GND  (via drill 0.6)  (1 unrouted)
  Top 0.305: IC7.7 v33.34,12.44 | C13.2 v31.11,22.6 | IC10.4 28.45,25.77 C14.2 27.81,26.41 v25.72,26.41 | 18.73,16.57 QG1.2 v16.51,16.57 | C12.2 16.51,4.95 v16.51,7.04 | v9.53,87.05 12.7,87.05 R13.1 13.01,86.91 13.01,85.47 | IC3.55 29.73,40.05 C5.2 30.16,39.62 v30.16,37.84 | SP1.1 38.73,5.87 38.73,6.09 38.42,6.41 38.42,7.04 36.83,8.63 24.77,8.63 22.54,10.85 22.54,32.12 25.72,35.3 v26.04,35.3 | IC3.33 23.87,51.75 v23.18,52.45 | 45.37,36.57 IC1.1 45.2,36.14 46.04,35.3 49.53,35.3 49.85,35.62 v49.85,38.48 | IC9.1 49.56,8.95 v51.44,8.95 | IC11.1 46.96,31.17 v45.09,31.17 | IC6.6 13.01,85.47 | 13.65,85.47 13.97,85.47 14.3,85.13 IC6.4 | 13.65,85.47 13.01,85.47 | C11.2 9.53,83.56 11.43,85.47 13.01,85.47 | IC6.11 13.01,80.06 v13.02,80.07 | v34.61,56.89 C4.2 32.7,56.89 32.38,56.57 | IC3.21 32.23,56.42 32.38,56.57 | IC3.20 32.73,56.23 32.38,56.57 | IC3.25 30.23,54.92 29.84,55.3 v28.26,55.3 | IC6.5 13.64,85.45 13.65,85.47 | X1.5 52.35,41.97 v49.85,41.97 49.85,44.98 R6.1 | v13.97,59.75 C10.2 13.97,57.84 16.19,55.62 16.19,55.47 R10.1 | IC3.9 37.72,48.25 v38.42,48.95 40.77,48.95 C8.2 | C1.- 40.23,36.89 v38.1,36.89
  Top 0.61: CON2.1 35.17,89.35 IC4.1 | v45.72,74.03 C3.2 48.8,72.26 C2.- | IC2.1 38.02,67.61 37.95,67.69 v36.2,67.69 | C6.2 37.97,61.97 | 37.97,61.97 v36.2,61.97 | C7.- 41.05,61.97 37.97,61.97 | v43.5,61.97 41.27,61.97
  Bottom 2.54: SCREW2.P$1 63.82,2.6 7.3,2.6 SCREW4.P$1 5.08,21.33
  Bottom 3.81: CON2.1 31.75,92.77 19.68,92.77 5.08,78.16 5.08,75.31
  pour Route2 (isolate 0.305): 0,95.94 0,0.06 71.12,0.06 71.12,9.9 61.28,9.9 61.28,17.2 57.15,17.2 57.15,23.23 61.28,23.23 61.28,85.78 71.12,85.78 71.12,95.94
  pour Top (isolate 0.406, rank 2): 5.4,47.68 1.27,47.68 1.27,20.7 7.94,20.7 7.94,35.3 5.4,35.3
  pour Bottom (isolate 0.406): 7.94,75.31 0.95,75.31 1.27,20.7 7.94,20.7
GNDIO  (via drill 0.6)
  Top 0.305: IC13.2 76.2,46.09 | 76.2,46.09 v77.47,47.37 | IC13.3 74.93,45.46 75.56,46.09 76.2,46.09 | v68.58,41.65 IC13.8 68.58,46.73 C16.2 | C17.2 68.58,64.51 IC12.8 v68.58,59.43 | IC12.3 74.93,62.92 75.56,63.56 v76.2,63.56 | v76.2,63.56 IC12.2 | IC12.1 77.47,62.92 76.83,63.56 v76.2,63.56 | C15.- 80.64,67.14 DIS1.15
  pour Route15: 82.55,24.82 63.5,24.82 63.5,71.5 82.55,71.5
IN0  (1 unrouted)
  Top 0.305: 7.94,55.3 7.94,58.16 SV1.29
IN1  (via drill 0.6)
  Top 0.305: IC7.11 v35.24,16.25
  Bottom 0.305: v35.24,16.25 34.29,15.3 32.7,15.3 25.72,22.28 25.08,22.28 24.77,21.96 11.75,21.96 10.16,23.55 10.16,49.27 9.53,49.91 9.53,51.49 SV1.25
LED
  Top 0.305: IC3.17 34.23,55.24 35.56,56.57 35.56,57.21 34.92,57.84 34.92,72.77 38.1,75.94 44.77,75.94 53.34,84.51 55.72,84.51 R12.1
LINKSPEED  (via drill 0.6)
  Top 0.305: SV1.13 SV1.15 9.53,44.51 9.53,47.37 10.48,48.32 14.61,48.32 v15.24,48.95 15.88,48.32 19.68,48.32 20.12,48.75 IC3.39 | IC5.15 17.78,27.68 11.11,27.68 10.16,28.63 10.16,36.89 11.11,37.84 11.75,37.84 15.24,41.33 v15.24,46.73
  Bottom 0.305: v15.24,46.73 v15.24,48.95
N$1  (via drill 0.6)
  Top 0.305: IC12.4 v73.66,59.43
  Bottom 0.305: DIS1.3 69.53,40.7 69.53,55.3 v73.66,59.43
N$2
  Top 0.305: IC13.4 73.66,45.46 74.61,46.41 74.61,46.73 78.74,50.86 78.74,52.45 DIS1.19
N$3
  Top 0.305: IC13.5 72.39,42.28 72.71,41.97 77.79,41.97 78.74,42.92 78.74,49.91 DIS1.20
N$4
  Top 0.305: IC13.6 71.12,42.28 72.07,41.33 78.11,41.33 80.33,43.55 80.64,43.87 DIS1.23
N$5
  Top 0.305: IC13.7 69.85,42.28 71.44,40.7 79.69,40.7 DIS1.24
N$6
  Top 0.305: IC13.9 68.58,35.94 71.75,39.11 DIS1.25
N$7
  Top 0.305: IC13.10 69.85,35.94 72.07,38.16 79.06,38.16 DIS1.26
N$8
  Top 0.305: IC13.11 71.12,35.94 72.71,37.52 77.79,37.52 78.74,36.57 78.74,35.94 DIS1.27
N$9
  Top 0.305: DIS1.28 73.98,31.49 72.39,33.08 IC13.12
N$10  (via drill 0.6)
  Top 0.305: IC12.5 v72.39,59.43
  Bottom 0.305: DIS1.4 67.31,41.02 67.31,42.28 68.9,43.87 68.9,55.94 v72.39,59.43
N$11  (via drill 0.6)
  Top 0.305: IC12.6 v71.12,59.43
  Bottom 0.305: DIS1.5 68.26,44.51 68.26,56.57 v71.12,59.43
N$12  (via drill 0.6)
  Top 0.305: IC12.7 v69.85,59.43
  Bottom 0.305: DIS1.6 67.63,46.41 67.63,57.21 v69.85,59.43
N$13
  Top 0.305: IC12.9 68.58,53.72 67.94,54.35 DIS1.10
N$14
  Bottom 0.305: J6.2 78.74,64.51 78.74,36.25 75.56,33.08 J5.2
N$15  (via drill 0.6)
  Top 0.305: IC13.16 v77.47,36.57 | IC13.1 v77.47,45.78 | C16.1 v73.66,46.73 | IC12.16 77.47,53.72 DIS1.18 | C17.1 v73.66,64.51 | C15.+ 80.24,70.54 v77.79,70.54
  pour Route2: 82.55,24.82 63.5,24.82 63.5,71.5 82.55,71.5
N$16  (via drill 0.6)
  Top 0.305: v71.12,49.91 IC12.11
  Bottom 0.305: DIS1.1 71.12,37.2 v71.12,49.91
N$17
  Top 0.305: DIS1.13 67.31,60.06 67.31,56.26 69.85,53.72 IC12.10
N$18  (via drill 0.6)
  Top 0.305: IC12.14 v74.93,49.91 | v74.93,36.57 IC13.14
  Bottom 0.305: v74.93,49.91 v74.93,36.57 74.93,34.98 70.48,30.54 J5.4
N$19
  Top 0.305: IC12.12 72.39,53.72 73.03,54.35 75.56,54.35 DIS1.17
N$20  (via drill 0.6)
  Top 0.305: IC12.15 v76.2,49.91 | v76.2,36.57 IC13.15
  Bottom 0.305: v76.2,49.91 v76.2,36.57 76.2,34.98 73.03,31.81 J5.3
N$21  (via drill 0.6)  (1 unrouted)
  Top 0.305: IC10.8 40.64,29.59 R20.1 40.79,28.95 v42.86,28.95
  Bottom 0.305: v42.86,28.95 43.81,28.95 48.9,23.87 48.9,17.65 J4.1
N$22  (via drill 0.6)  (1 unrouted)
  Top 0.305: IC10.7 38.58,28.32 R20.2 40.79,26.41 v42.86,26.41
  Bottom 0.305: v42.86,26.41 45.4,26.41 48.26,23.55 48.26,17.84 47.31,16.89 J4.2
N$23
  Top 0.305: IC10.5 38.73,25.77 40.01,24.5 J4.8
N$24
  Top 0.305: IC10.6 35.88,27.05 35.56,26.73 35.56,25.14 35.88,24.82 38.42,24.82 40.01,23.23 J4.7
N$25
  Top 0.305: R18.1 29.68,13.71 IC7.6
N$26
  Top 0.305: R17.1 28.11,17.52 IC7.3
N$27
  Top 0.305: IC7.9 39.05,13.71 40.47,12.29 R16.1
N$28
  Top 0.305: R16.2 R19.1 41.11,18.16 J4.3 48.26,16.76 48.26,11.95 IC9.3
N$29  (via drill 0.6)
  Top 0.305: IC9.2 48.9,11.31 48.9,17.84 47.31,19.43 J4.4 | R17.2 26.35,18.94 v26.35,10.85
  Bottom 0.305: v26.35,10.85 27.3,9.9 33.97,9.9 43.5,19.43 J4.4
N$30  (via drill 0.6)
  Top 0.305: J4.5 48.26,22.09 48.26,28.17 IC11.2 | v27.94,10.85 R18.2
  Bottom 0.305: J4.5 43.81,20.7 33.97,10.85 v27.94,10.85
N$31
  Top 0.305: IC3.53 28.73,36.09 CON1.2
N$32
  Top 0.305: IC10.2 32.7,28.32 34.29,26.73 34.29,18.47 35.24,17.52 IC7.12
N$33
  Top 0.305: D2.3 43.18,54.52 43.18,56.89 45.72,59.43 R15.1 48.26,60.85 48.26,63.24 52.07,67.05 J3.3
N$34
  Top 0.305: IC3.31 27.23,56.65 TP1.P$1
N$35  (via drill 0.6)
  Top 0.305: IC3.52 28.23,37.49 v27.62,36.89
  Bottom 0.305: CON1.4 v27.62,36.89
N$36
  Top 0.305: CON1.10 34.23,36.51 34.23,39.74 | 34.23,39.74 IC3.64 | R4.1 34.23,39.74
N$37  (via drill 0.6)
  Top 0.305: R5.1 v48.26,38.48 | IC3.26 29.73,52.24 32.07,49.91 v33.66,49.91 | R6.2 v48.26,41.97
  Bottom 0.305: v48.26,38.48 v48.26,41.97 41.59,41.97 v33.66,49.91
N$38
  Top 0.305: IC3.5 37.31,46.25 40.32,43.24 41.74,43.24 R8.2
N$39
  Top 0.305: IC3.6 37.76,46.75 40.64,43.87 43.65,43.87 R7.2
N$40
  Top 2.54: SCREW1.P$1 63.82,93.4 7.3,93.4 SCREW3.P$1 5.08,74.67
  pour Top: 14.92,79.43 14.92,75.94 14.29,75.31 7.94,75.31 7.94,72.45 14.92,72.45 17.46,74.99 17.46,79.43
  pour Top (isolate 0.406): 5.4,48.32 1.27,48.32 1.27,75.31 7.94,75.31 7.94,60.7 5.4,60.7
  pour Route15 (isolate 0.406): 5.4,48.32 1.27,48.32 1.27,75.31 7.94,75.31 7.94,60.7 5.4,60.7
N$41
  Top 0.305: IC5.20 20.32,42.92 20.32,45.78 22.29,47.75 IC3.41
N$42
  Top 0.305: IC3.32 26.73,54.61 25.72,55.62 TP2.P$1
N$43  (via drill 0.6)
  Top 0.305: IC3.61 32.73,45.43 v32.38,45.78
  Route15 0.305: v32.38,45.78 43.5,45.78 TP4.P$1
N$44  (1 unrouted)
N$45
  Top 0.305: IC5.19 20.95,41.02 20.95,45.46 22.25,46.75 IC3.43
N$46
  Top 0.305: IC5.18 21.59,39.11 21.59,45.14 22.7,46.25 IC3.44
N$47
  Top 0.305: IC5.7 12.7,35.3 19.37,35.3 22.23,38.16 22.23,44.83 23.15,45.75 IC3.45
N$48
  Top 0.305: IC5.17 19.37,34.03 22.86,37.52 22.86,44.51 23.6,45.25 IC3.46
N$49
  Top 0.305: IC5.8 12.7,32.76 19.37,32.76 23.5,36.89 23.5,44.19 24.05,44.75 IC3.47
N$50
  Top 0.305: IC5.16 24.13,36.57 24.13,43.87 24.51,44.25 IC3.48
N$51
  Top 0.305: IC5.10 12.7,30.22 19.37,30.22 20.32,31.17 20.32,31.81 25.72,37.2 25.72,38.79 26.73,39.8 IC3.49
N$52  (via drill 0.6)
  Top 0.305: IC3.60 32.23,44.34 30.16,46.41 27.3,46.41 v26.99,46.09
  Bottom 0.305: IC5.3 12.38,45.78 26.67,45.78 v26.99,46.09
N$53  (via drill 0.6)
  Top 0.305: IC3.59 31.73,43.89 30.16,45.46 v29.84,45.46
  Bottom 0.305: IC5.6 14.92,42.6 28.26,42.6 29.84,44.19 v29.84,45.46
N$54  (via drill 0.6)
  Top 0.305: IC3.58 31.23,43.44 30.16,44.51 v28.89,44.51
  Bottom 0.305: IC5.5 13.02,43.24 27.62,43.24 v28.89,44.51
N$55  (via drill 0.6)
  Top 0.305: v30.16,47.37 30.48,47.68 32.7,47.68 33.97,46.41 33.97,44.83 34.55,44.25 IC3.1
  Bottom 0.305: IC5.4 12.38,45.14 27.3,45.14 29.53,47.37 v30.16,47.37
N$56  (via drill 0.6)
  Top 0.305: v26.99,47.37 27.3,47.05 28.57,47.05 29.84,48.32 33.02,48.32 34.61,46.73 34.61,45.14 35,44.75 IC3.2
  Bottom 0.305: IC5.22 20.32,46.73 20.64,47.05 26.67,47.05 v26.99,47.37
N$57  (via drill 0.6)
  Top 0.305: IC3.63 33.73,44.12 33.34,44.51 33.34,46.09 32.7,46.73 v31.43,46.73
  Bottom 0.305: IC5.21 27.3,44.19 29.53,46.41 31.11,46.41 v31.43,46.73
N$58
  Top 0.305: IC5.13 12.06,16.89 11.16,16.89 QG1.3
N$59
  Top 0.305: D1.3 41.91,56.89 46.84,61.82 R14.1 46.84,63.09 52.39,68.64 52.39,73.72 J2.3
N$60  (via drill 0.6)
  Top 0.305: 11.56,55.17 C9.2 v11.43,53.4
  Bottom 0.305: IC5.23 17.46,49.27 13.34,53.4 v11.43,53.4
N$61
  Top 0.305: X1.2 46.34,39.58 R7.1 43.5,36.74 IC1.2
N$62
  Top 0.305: X1.3 44.6,40.38 R8.1 42.23,38.01 42.23,35.62 43.5,34.34 IC1.3
N$63
  Top 0.305: R13.2 LED2.C
N$64
  Top 0.305: SP1.2 R9.2
N$65
  Top 0.305: LED1.C R12.2
N$67
  Bottom 0.61: J3.2 55.24,69.59 53.34,71.5 53.34,75.94 | 53.34,75.94 53.34,77.84 55.24,79.75 J2.2 | IC8.6 33.66,75.94 53.34,75.94
N$71  (via drill 0.6)
  Top 0.305: IC3.50 27.23,39.03 v26.67,38.48
  Bottom 0.305: v26.67,38.48 27.3,38.48 CON1.6
N$72  (via drill 0.6)
  Top 0.305: IC3.38 26.37,49.25 v26.99,48.63 | v19.05,53.4 R11.1
  Bottom 0.305: v26.99,48.63 21.91,48.63 20,50.54 20,52.45 v19.05,53.4
N$73  (via drill 0.6)  (1 unrouted)
  Top 0.305: v23.81,32.12 33.02,32.12 37.15,36.25 37.15,42.28 37.78,42.92 37.78,44.83 37.36,45.25 IC3.3
  Bottom 0.305: IC5.11 12.7,27.68 19.37,27.68 v23.81,32.12
OUT0
  Bottom 0.305: IC5.2 10.16,50.54 10.16,53.4 SV1.27
OUT1  (via drill 0.6)
  Top 0.305: IC10.3 32.7,27.05 33.02,26.73 33.02,25.14 32.7,24.82 28.89,24.82 v25.4,21.33
  Bottom 0.305: v25.4,21.33 11.43,21.33 9.53,23.23 9.53,48.95 SV1.23
PON  (via drill 0.6)
  Top 0.305: IC4.2 27.03,89.28 v25.4,89.28 | v35.24,18.79 IC7.13 | IC3.37 22.39,49.75 v22.23,49.59 | v16.51,59.75 R10.2
  Bottom 0.305: v25.4,89.28 25.4,72.13 20.64,67.37 20.64,59.75 | v35.24,18.79 35.88,19.43 35.88,46.41 32.07,50.22 30.16,50.22 29.53,50.86 26.67,50.86 25.4,49.59 v22.23,49.59 20.64,51.17 20.64,59.75 | v16.51,59.75 20.64,59.75
RESET  (via drill 0.6)
  Top 0.305: IC7.1 32.7,20.06 33.34,19.43 v33.34,18.79 IC7.2 | SV1.17 8.89,46.41 8.89,48.32 10.79,50.22 21.59,50.22 21.91,50.54 22.6,50.54 22.89,50.25 IC3.36 26.64,50.25 v26.99,49.91
  Bottom 0.305: v33.34,18.79 33.34,20.06 34.61,21.33 34.61,45.78 31.43,48.95 27.94,48.95 v26.99,49.91
SCL  (via drill 0.6)
  Top 0.305: IC6.9 11.68,80.64 12.38,81.34 16.51,81.34 18.41,79.43 18.41,68.95 28.26,59.11 v33.97,59.11 | IC3.18 33.73,51.73 v34.29,51.17 | R1.1 53.49,54.35 J1.4
  Bottom 0.305: v34.29,51.17 33.66,51.81 33.66,58.8 v33.97,59.11 39.05,59.11 43.81,54.35 J1.4
SDA  (via drill 0.6)
  Top 0.305: IC6.8 11.68,82.67 12.38,81.97 16.83,81.97 19.05,79.75 19.05,69.27 28.26,60.06 v33.02,60.06 | IC3.19 33.23,51.38 v33.02,51.17 | R2.1 53.49,56.89 J1.3
  Bottom 0.305: v33.02,51.17 v33.02,60.06 39.05,60.06 44.13,54.98 53.98,54.98 J1.3
SPEAKER
  Top 0.305: R9.1 21.91,8.48 21.91,32.44 27.73,38.27 IC3.51
TEST
  Top 0.305: IC3.40 20.57,48.25 20,47.68 10.79,47.68 10.16,47.05 10.16,40.06 SV1.11
VCC  (via drill 0.6)  (1 unrouted)
  Top 0.305: IC10.1 28.45,29.59 C14.1 27.81,28.95 v25.72,28.95 | C13.1 v37.47,22.6 37.47,20.06 | 37.47,20.06 IC7.14 | CON2.2 52.39,86.1 53.51,87.22 LED1.A | 37.47,20.06 40.17,20.06 R19.2 | IC9.4 v45.09,8.95 | IC11.4 v51.44,31.17 | C11.1 v9.53,77.84 10.79,76.58 12.38,76.58 | IC6.12 13.64,76.88 13.34,76.58 12.38,76.58 | IC6.10 12.34,76.61 12.38,76.58 | v51.44,61.97 R14.2 R15.2 | v45.09,50.54 R1.2 R2.2
  Top 0.61: 41.91,80.07 40.64,80.07 | v45.72,67.69 C3.1 | v45.72,67.69 45.7,67.71 IC2.3 | C2.+ 47.22,67.69 v45.72,67.69
  Top 3.81: CON2.2 41.91,80.07 25.4,80.07 IC4.6
  pour Route15 (isolate 0.305, rank 2): 0,95.94 0,0.06 71.12,0.06 71.12,9.9 61.28,9.9 61.28,17.2 57.15,17.2 57.15,23.23 61.28,23.23 61.28,85.78 71.12,85.78 71.12,95.94
VCCINT  (via drill 0.6)  (1 unrouted)
  Top 0.305: QG1.4 v13.97,11.49 | C12.1 13.97,4.95 v13.97,11.49 | v13.97,11.49 QG1.1 | IC5.24 17.33,51.81 C10.1 13.34,55.81 13.34,55.94 11.43,57.84 C9.1 | 16.83,87.22 16.83,87.37
  Route15 1.27: 16.83,51.81 16.83,55.94 18.73,57.84 18.73,61.65 15.24,65.14 IC8.2 15.24,73.72 17.78,76.26 v17.78,83.56 | IC5.24 16.83,51.81 | 16.83,51.81 16.83,22.28 13.97,19.43 v13.97,11.49
  pour Top: 14.92,82.61 14.92,86.1 20,91.18 22.54,91.18 22.54,87.37 20.32,87.37 18.73,85.78 18.73,82.61
VDD  (via drill 0.6)
  Top 0.305: IC3.56 30.23,41.27 30.48,41.02 31.56,41.02 C5.1 32.7,39.62 v32.7,37.84 | IC3.34 22.47,51.25 v22.23,51.49 | IC3.22 31.73,55.01 31.43,55.3 31.23,55.3 | IC3.24 30.73,55.3 | 30.73,55.3 30.73,56.19 C4.1 v28.26,56.89 | IC3.23 31.23,55.3 | 31.23,55.3 30.73,55.3 | R3.2 v45.09,56.89 | v21.91,55.3 19.21,57.99 R11.2 | IC3.8 38.35,47.75 v38.42,47.68 39.24,47.68 C8.1 | R4.2 v40.32,39.74
  Top 0.61: C7.+ 41.36,64.83 | 41.36,64.83 v43.5,64.83 | 41.36,64.83 40.64,64.83 | 40.64,64.83 38.42,64.83 38.23,64.64 C6.1 | IC2.2 40.64,67.39 40.64,64.83 | 38.33,64.83 v36.2,64.83
  Route15 0.305: v45.09,56.89 43.5,56.89
  pour Route15 (isolate 0.305): 21.59,65.14 21.59,31.81 43.81,31.81 43.81,65.14
VUSB
  Top 0.305: 45.4,33.88 R5.2 49.38,33.88 50.8,35.3 50.8,38.16 51.42,38.78 X1.1 | 45.4,33.88 IC1.4 | 45.4,33.88 44.28,32.76 41.91,32.76 40.96,33.71 40.41,33.71 C1.+

### Text on the board
Bottom: STN UB-1